# Altium schematic sheet HA_Out.SchDoc: Piezo driver
size A4; Date: 03 oct 2018; Author: TO; Revision: ver B; SheetNumber: 1; PageSetup: Record=PageOptions|CenterHorizontal=True|CenterVertical=True|PrintScale=1.02|XCorrection=1.00|YCorrection=1.00|PrintKind=0|BorderSize=5000000|LeftOffset=0|BottomOffset=0|Orientation=2|PaperLength=1000|PaperWidth=1000|Scale=100|PaperSource=257|PrintQuality=600|MediaType=1|DitherType=10|PrintScaleMode=1|PaperKind=A4 (Borderless)|PaperIndex=123
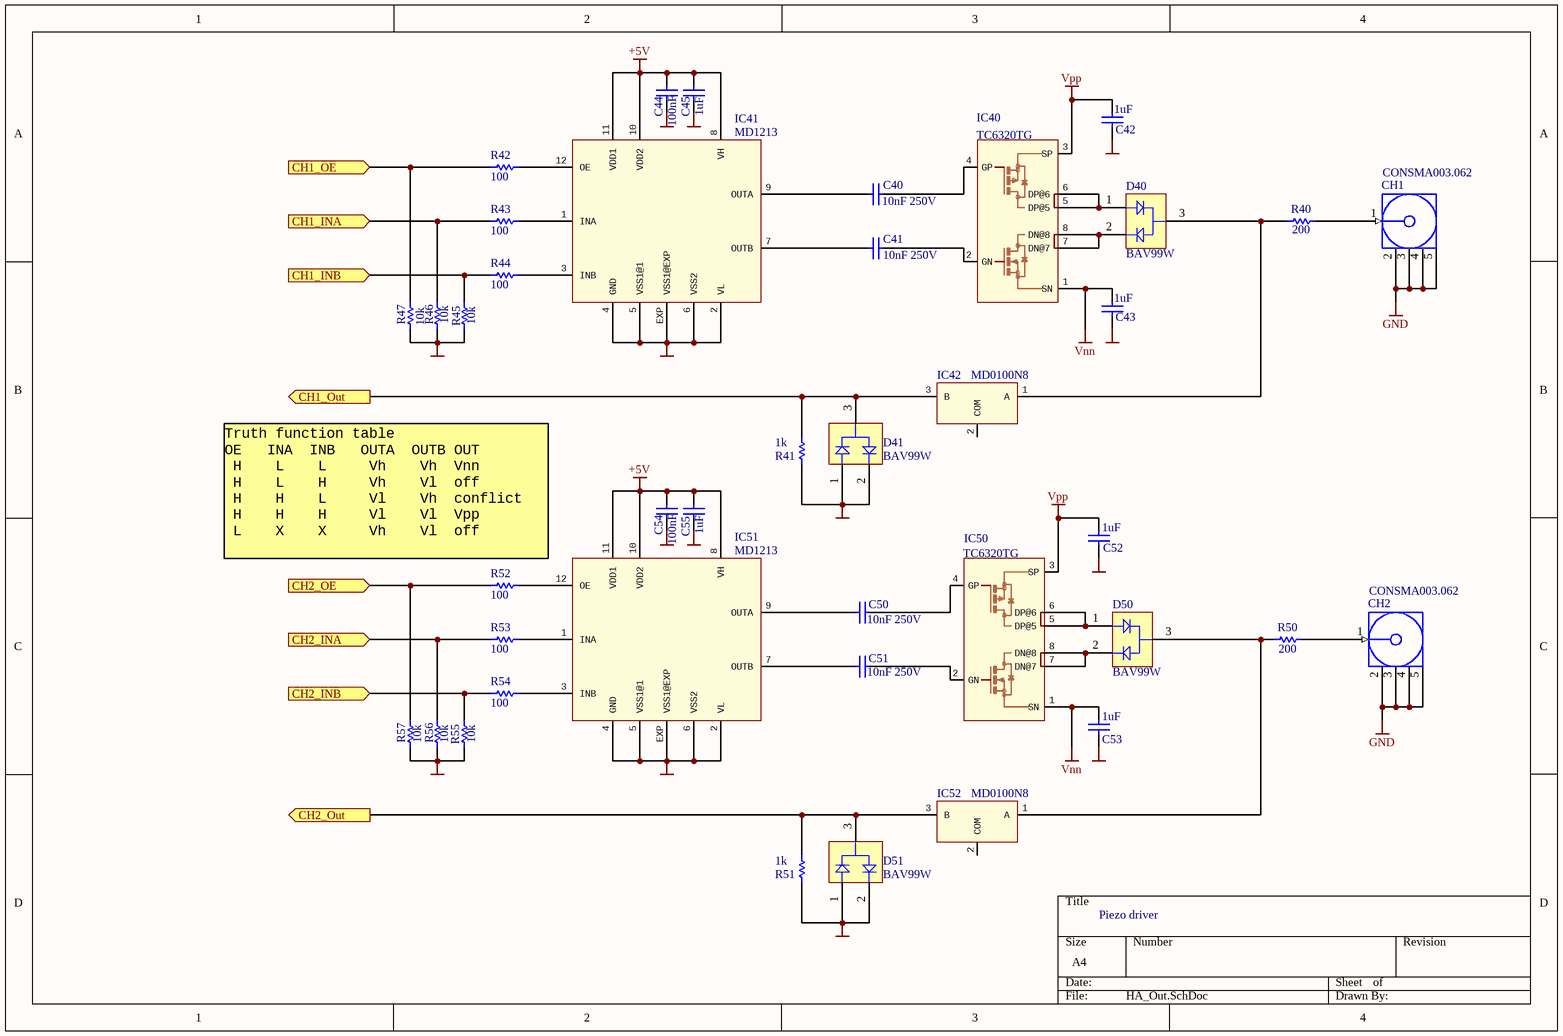
[diagram p0: HA_Out.SchDoc]

## Parts
C40  10nF 250V  [CAPC0805(2012)75_N]
C41  10nF 250V  [CAPC0805(2012)75_N]
C42  1uF  [CAPC1206(3216)190_N]
C43  1uF  [CAPC1206(3216)190_N]
C44  100nF  [CAPC0805(2012)75_N]
C45  1uF  [CAPC0805(2012)75_N]
C50  10nF 250V  [CAPC0805(2012)75_N]
C51  10nF 250V  [CAPC0805(2012)75_N]
C52  1uF  [CAPC1206(3216)190_N]
C53  1uF  [CAPC1206(3216)190_N]
C54  100nF  [CAPC0805(2012)75_N]
C55  1uF  [CAPC0805(2012)75_N]
CH1  CONSMA003.062  [CON-SMA-EDGE062]
CH2  CONSMA003.062  [CON-SMA-EDGE062]
D40  BAV99W  [INF-SOT323_M]
D41  BAV99W  [INF-SOT323_M]
D50  BAV99W  [INF-SOT323_M]
D51  BAV99W  [INF-SOT323_M]
IC40  TC6320TG  [SO08]
IC41  MD1213  [AMS-QFN-12-4000X4000DE-2125X2125TP_L]
IC42  MD0100N8  [SOT89]
IC50  TC6320TG  [SO08]
IC51  MD1213  [AMS-QFN-12-4000X4000DE-2125X2125TP_L]
IC52  MD0100N8  [SOT89]
R40  200  [RESC0805(2012)_L]
R41  1k  [RESC0805(2012)_L]
R42  100  [RESC0805(2012)_L]
R43  100  [RESC0805(2012)_L]
R44  100  [RESC0805(2012)_L]
R45  10k  [RESC0805(2012)_L]
R46  10k  [RESC0805(2012)_L]
R47  10k  [RESC0805(2012)_L]
R50  200  [RESC0805(2012)_L]
R51  1k  [RESC0805(2012)_L]
R52  100  [RESC0805(2012)_L]
R53  100  [RESC0805(2012)_L]
R54  100  [RESC0805(2012)_L]
R55  10k  [RESC0805(2012)_L]
R56  10k  [RESC0805(2012)_L]
R57  10k  [RESC0805(2012)_L]

## Ports
CH1_INA (in), CH1_INB (in), CH1_OE (in), CH1_Out (out), CH2_INA (in), CH2_INB (in), CH2_OE (in), CH2_Out (out)

## Nets
+5V: C44.2 C45.2 C54.2 C55.2 IC41.8(VH) IC41.10(VDD2) IC41.11(VDD1) IC51.8(VH) IC51.10(VDD2) IC51.11(VDD1)
GND: C42.1 C43.1 C44.1 C45.1 C52.1 C53.1 C54.1 C55.1 CH1.2(GND) CH1.3(GND) CH1.4(GND) CH1.5(GND) CH2.2(GND) CH2.3(GND) CH2.4(GND) CH2.5(GND) D41.1(A1) D41.2(K2) D51.1(A1) D51.2(K2) IC41.2(VL) IC41.4(GND) IC41.5(VSS1@1) IC41.6(VSS2) IC41.EXP(VSS1@EXP) IC51.2(VL) IC51.4(GND) IC51.5(VSS1@1) IC51.6(VSS2) IC51.EXP(VSS1@EXP) R41.2 R45.2 R46.2 R47.2 R51.2 R55.2 R56.2 R57.2
Vnn: C43.2 C53.2 IC40.1(SN) IC50.1(SN)
Vpp: C42.2 C52.2 IC40.3(SP) IC50.3(SP)
CH1_INA: R43.1 R46.1 ; port CH1_INA
CH1_INB: R44.1 R45.1 ; port CH1_INB
CH1_OE: R42.1 R47.1 ; port CH1_OE
CH1_Out: D41.3(C) IC42.3(B) R41.1 ; port CH1_Out
CH2_INA: R53.1 R56.1 ; port CH2_INA
CH2_INB: R54.1 R55.1 ; port CH2_INB
CH2_OE: R52.1 R57.1 ; port CH2_OE
CH2_Out: D51.3(C) IC52.3(B) R51.1 ; port CH2_Out
NetC40_1: C40.1 IC40.4(GP)
NetC40_2: C40.2 IC41.9(OUTA)
NetC41_1: C41.1 IC40.2(GN)
NetC41_2: C41.2 IC41.7(OUTB)
NetC50_1: C50.1 IC50.4(GP)
NetC50_2: C50.2 IC51.9(OUTA)
NetC51_1: C51.1 IC50.2(GN)
NetC51_2: C51.2 IC51.7(OUTB)
NetCH1_1: CH1.1(Signal) R40.2
NetCH2_1: CH2.1(Signal) R50.2
NetD40_1: D40.1(A1) IC40.5(DP@5) IC40.6(DP@6)
NetD40_2: D40.2(K2) IC40.7(DN@7) IC40.8(DN@8)
NetD40_3: D40.3(C) IC42.1(A) R40.1
NetD50_1: D50.1(A1) IC50.5(DP@5) IC50.6(DP@6)
NetD50_2: D50.2(K2) IC50.7(DN@7) IC50.8(DN@8)
NetD50_3: D50.3(C) IC52.1(A) R50.1
NetIC41_1: IC41.1(INA) R43.2
NetIC41_3: IC41.3(INB) R44.2
NetIC41_12: IC41.12(OE) R42.2
NetIC51_1: IC51.1(INA) R53.2
NetIC51_3: IC51.3(INB) R54.2
NetIC51_12: IC51.12(OE) R52.2

Not connected (* = marked no-connect by the designer): IC42 2(COM); IC52 2(COM)

## Notes on the sheet
- Truth function table
  OE   INA  INB   OUTA  OUTB OUT
  H    L    L     Vh    Vh  Vnn
  H    L    H     Vh    Vl  off
  H    H    L     Vl    Vh  conflict
  H    H    H     Vl    Vl  Vpp
  L    X    X     Vh    Vl  off
- Title
- Size:
- Date:
- A4
- Number:
- Time:
- Revision:
- Sheet
- of
- File:

## Library data of the parts
C40 C41 C50 C51 = CMP-1036-00417-1: CAP 0805 (2012 Metric) Thickness 0.75mm SMD; Case-EIA: 0805; Tolerance: ±10%; Case-Metric: 2012; Technology: SMT; Max Thickness: 0.75 mm; Value: 10nF; Rated Voltage: 250 V
C42 C43 C52 C53 = CMP-1037-04411-1: CAP 1206 (3216 Metric) Thickness 1.9mm SMD; Case-Metric: 3216; Tolerance: Â±20%; Rated Voltage: 100 V; Case-EIA: 1206; Max Thickness: 1.9 mm; Technology: SMT; Value: 1uF
C44 C45 C54 C55 = CMP-1036-00417-1: Case-EIA: 0805; Tolerance: ±10%; Case-Metric: 2012; Rated Voltage: 10 V; Technology: SMT; Max Thickness: 0.75 mm
  C44 C54: Value: 100nF
  C45 C55: Value: 1uF
CH1 CH2 = CMP-0168-00029-1: SMA Female Edge Mount Connector for 0.062" Thick Board; PCB_Layout: Pads complies with manufacturer's recommendation.; PackageReference: CON-SMA-EDGE062; PackageDescription: SMA Female Edge Mount Connector for 0.062" Thick Board, 7.9 mm Body Dia.; PackageVersion: rev1.0, Aug-2006; DatasheetVersion: rev1.0, Aug-2006
D40 D41 D50 D51 = CMP-1176-00026-1: Silicon Switching Diode, SOT323, Reel, Green; Manufacturer: Diodes Inc; MPN: BAV99W-7-F; PackageReference: SOT323; Value: BAV99W
IC40 IC50 = TC6320: Manufacturer: Microchip; MPN: TC6320TG-G; Value: TC6320TG
IC41 IC51 = MD1213: Manufacturer: Microchip; MPN: MD1213K6-G; Value: MD1213
IC42 = MD0100N8: MPN: MD0100N8-G; Manufacturer: Microchip; Value: MD0100N8
IC52 = MD0100N8: Manufacturer: Microchip; MPN: MD0100N8-G; Value: MD0100N8
R40-R47 R50-R57 = CMP-1013-00429-1: 0.125W 1% 0805 (2012 Metric)  SMD; Case-EIA: 0805; Case-Metric: 2012; Technology: SMT; Power: 0.125 W; Tolerance: 1 %
  R40 R50: Value: 200
  R41 R51: Value: 1k
  R42-R44 R52-R54: Value: 100
  R45-R47 R55-R57: Value: 10k